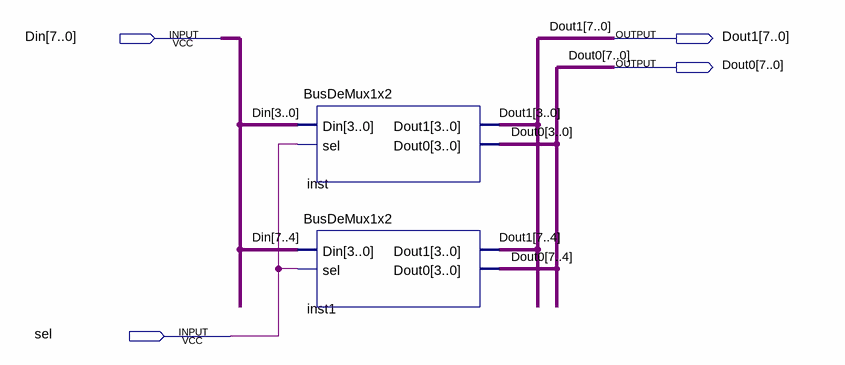
[diagram p0: schematic sheet]
// Quartus schematic DeMux8bit1x2.bdf as structural Verilog: 2 symbols, 4 pins
module DeMux8bit1x2 (
  input  [7:0] Din,
  input  sel,
  output [7:0] Dout1,
  output [7:0] Dout0
);

  BusDeMux1x2 inst (.Din(Din[3:0]), .sel(sel), .Dout1(Dout1[3:0]), .Dout0(Dout0[3:0]));
  BusDeMux1x2 inst1 (.Din(Din[7:4]), .sel(sel), .Dout1(Dout1[7:4]), .Dout0(Dout0[7:4]));
endmodule
